# Altium schematic sheet PWR_BUCK.SchDoc
size 420 x 297 mm; SheetNumber: 2; SheetTotal: 2
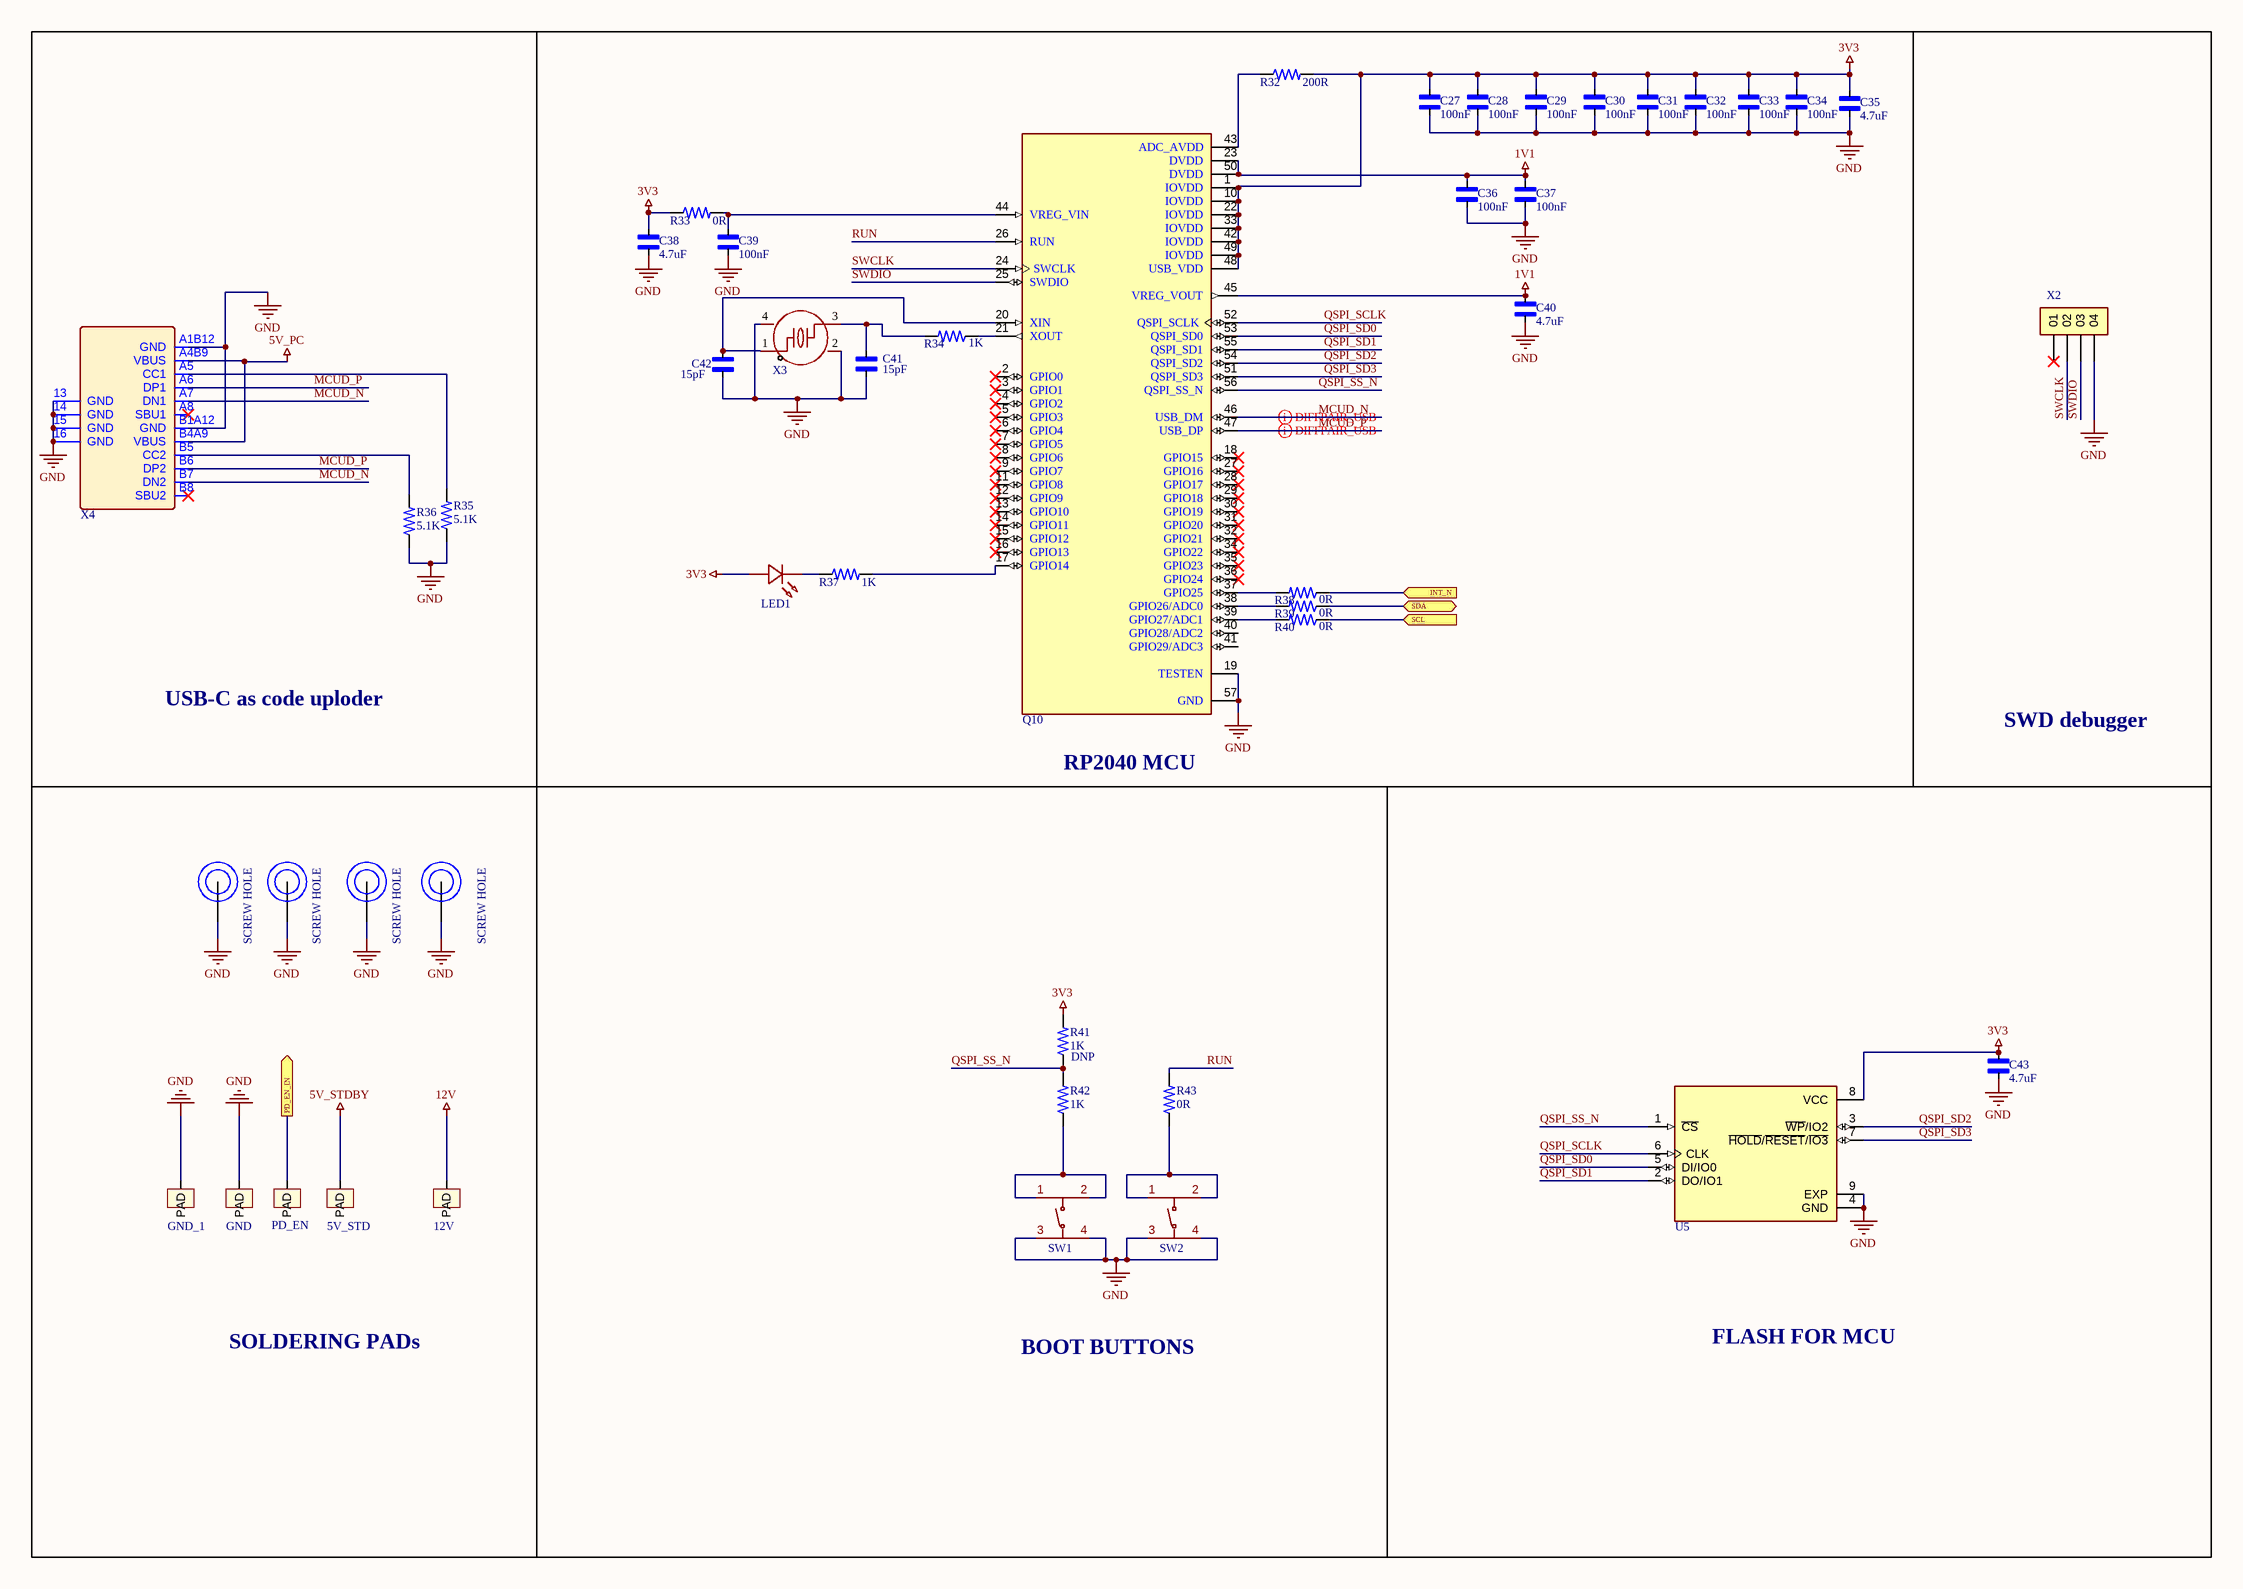
[diagram p0: PWR_BUCK.SchDoc]

## Parts
5V_STD  solder pad  [1mm hole]  (value not drawn)
12V  solder pad  [14 awg]  (value not drawn)
C27  value 100nF  [CAP_0603]  (hidden comment: SMD capacitor)
C28  value 100nF  [CAP_0603]  (hidden comment: SMD capacitor)
C29  value 100nF  [CAP_0603]  (hidden comment: SMD capacitor)
C30  value 100nF  [CAP_0603]  (hidden comment: SMD capacitor)
C31  value 100nF  [CAP_0603]  (hidden comment: SMD capacitor)
C32  value 100nF  [CAP_0603]  (hidden comment: SMD capacitor)
C33  value 100nF  [CAP_0603]  (hidden comment: SMD capacitor)
C34  value 100nF  [CAP_0603]  (hidden comment: SMD capacitor)
C35  value 4.7uF  [CAP_0603]  (hidden comment: SMD capacitor)
C36  value 100nF  [CAP_0603]  (hidden comment: SMD capacitor)
C37  value 100nF  [CAP_0603]  (hidden comment: SMD capacitor)
C38  value 4.7uF  [CAP_0603]  (hidden comment: SMD capacitor)
C39  value 100nF  [CAP_0603]  (hidden comment: SMD capacitor)
C40  value 4.7uF  [CAP_0603]  (hidden comment: SMD capacitor)
C41  value 15pF  [CAP_0603]  (hidden comment: SMD capacitor)
C42  value 15pF  [CAP_0603]  (hidden comment: SMD capacitor)
C43  value 4.7uF  [CAP_0603]  (hidden comment: SMD capacitor)
GND  solder pad  [14 awg]  (value not drawn)
GND_1  solder pad  [1mm hole]  (value not drawn)
LED1  LED  [LED0603-RD_RED]  (value not drawn)
PD_EN  solder pad  [1mm hole]  (value not drawn)
Q10  IC MCU 32BIT EXT MEM 56QFN  [QFN40P700X700X90-57N]  (value not drawn)
R32  value 200R  [RES_0603]  (hidden comment: SMD Resistor)
R33  value 0R  [RES_0603]  (hidden comment: SMD Resistor)
R34  value 1K  [RES_0603]  (hidden comment: SMD resistor)
R35  value 5.1K  [RES_0603]  (hidden comment: SMD resistor)
R36  value 5.1K  [RES_0603]  (hidden comment: SMD resistor)
R37  value 1K  [RES_0603]  (hidden comment: SMD Resistor)
R38  value 0R  [RES_0603]  (hidden comment: SMD resistor)
R39  value 0R  [RES_0603]  (hidden comment: SMD resistor)
R40  value 0R  [RES_0603]  (hidden comment: SMD resistor)
R41  DNP  value 1K  [RES_0603]
R42  value 1K  [RES_0603]  (hidden comment: SMD resistor)
R43  value 0R  [RES_0603]  (hidden comment: SMD resistor)
SH1  SCREW HOLE  [PCB hole]
SH2  SCREW HOLE  [PCB hole]
SH3  SCREW HOLE  [PCB hole]
SH4  SCREW HOLE  [PCB hole]
SW1  Dev  Switch  [SW-SMD_4P-L4.2-W3.3-P2.15-LS5.1]  (value not drawn)
SW2  Dev  Switch  [SW-SMD_4P-L4.2-W3.3-P2.15-LS5.1]  (value not drawn)
U5  SPI Flash  [IC_W25Q16JVUXIQ_TR]  (value not drawn)
X2  Header X 5  [SAMTEC_TS-104-T-A]  (value not drawn)
X3  Crystals  [CRYSTAL-SMD_4P-L3.2-W2.5-BL]  (value not drawn)
X4  USB-C connector  [USB-C-SMD_TYPEC-304J-BCP16]  (value not drawn)

## Ports
INT_N (in, see USB_PD_IC[4A]), PD_EN_IN (out, see USB_PD_IC[1B]), SCL (in, see USB_PD_IC[2A]), SDA (bidir, see USB_PD_IC[2A])

## Nets
1V1: C36.1 C37.1 C40.1 Q10.23(DVDD) Q10.45(VREG_VOUT) Q10.50(DVDD)
3V3: C27.1 C28.1 C29.1 C30.1 C31.1 C32.1 C33.1 C34.1 C35.1 C38.1 C43.1 LED1.2(A) Q10.1(IOVDD) Q10.10(IOVDD) Q10.22(IOVDD) Q10.33(IOVDD) Q10.42(IOVDD) Q10.48(USB_VDD) Q10.49(IOVDD) R32.2 R33.1 R41.2 U5.8(VCC)
5V_PC: X4.A4B9(VBUS) X4.B4A9(VBUS)
5V_STDBY: 5V_STD.1(PAD)
12V: 12V.1(PAD)
GND: C27.2 C28.2 C29.2 C30.2 C31.2 C32.2 C33.2 C34.2 C35.2 C36.2 C37.2 C38.2 C39.2 C40.2 C41.2 C42.2 C43.2 GND.1(PAD) GND_1.1(PAD) Q10.19(TESTEN) Q10.57(GND) R35.1 R36.1 SH1.1 SH2.1 SH3.1 SH4.1 SW1.3 SW1.4 SW2.3 SW2.4 U5.4(GND) U5.9(EXP) X2.04 X3.2(GND) X3.4(GND) X4.13(GND) X4.14(GND) X4.15(GND) X4.16(GND) X4.A1B12(GND) X4.B1A12(GND)
INT_N: R38.1 ; port INT_N
MCUD_N: Q10.46(USB_DM) X4.A7(DN1) X4.B7(DN2)
MCUD_P: Q10.47(USB_DP) X4.A6(DP1) X4.B6(DP2)
PD_EN_IN: PD_EN.1(PAD) ; port PD_EN_IN
QSPI_SCLK: Q10.52(QSPI_SCLK) U5.6(CLK)
QSPI_SD0: Q10.53(QSPI_SD0) U5.5(DI/IO0)
QSPI_SD1: Q10.55(QSPI_SD1) U5.2(DO/IO1)
QSPI_SD2: Q10.54(QSPI_SD2) U5.3(~{WP}/IO2)
QSPI_SD3: Q10.51(QSPI_SD3) U5.7(~{HOLD}/~{RESET}/~{IO3})
QSPI_SS_N: Q10.56(QSPI_SS_N) R41.1 R42.2 U5.1(~{CS})
RUN: Q10.26(RUN) R43.2
SCL: R40.1 ; port SCL
SDA: R39.1 ; port SDA
SWCLK: Q10.24(SWCLK) X2.02
SWDIO: Q10.25(SWDIO) X2.03
NetC39_1: C39.1 Q10.44(VREG_VIN) R33.2
NetC41_1: C41.1 R34.2 X3.3
NetC42_1: C42.1 Q10.20(XIN) X3.1
NetLED1_1: LED1.1(K) R37.1
NetQ10_17: Q10.17(GPIO14) R37.2
NetQ10_21: Q10.21(XOUT) R34.1
NetQ10_37: Q10.37(GPIO25) R38.2
NetQ10_38: Q10.38(GPIO26/ADC0) R39.2
NetQ10_39: Q10.39(GPIO27/ADC1) R40.2
NetQ10_43: Q10.43(ADC_AVDD) R32.1
NetR35_2: R35.2 X4.A5(CC1)
NetR36_2: R36.2 X4.B5(CC2)
NetR42_1: R42.1 SW1.1 SW1.2
NetR43_1: R43.1 SW2.1 SW2.2

Not connected (* = marked no-connect by the designer): Q10 2(GPIO0)* 3(GPIO1)* 4(GPIO2)* 5(GPIO3)* 6(GPIO4)* 7(GPIO5)* 8(GPIO6)* 9(GPIO7)* 11(GPIO8)* 12(GPIO9)* 13(GPIO10)* 14(GPIO11)* 15(GPIO12)* 16(GPIO13)* 18(GPIO15)* 27(GPIO16)* 28(GPIO17)* 29(GPIO18)* 30(GPIO19)* 31(GPIO20)* 32(GPIO21)* 34(GPIO22)* 35(GPIO23)* 36(GPIO24)* 40(GPIO28/ADC2) 41(GPIO29/ADC3); X2 01*; X4 A8(SBU1)* B8(SBU2)*

## Layout directives
differential pair; differential pair class USB: MCUD_N, MCUD_P

## Notes on the sheet
- USB-C as code uploder
- SWD debugger
- (near Q10) RP2040 MCU
- SOLDERING PADs
- BOOT BUTTONS
- FLASH FOR MCU

## Library data of the parts
C27-C43 = CAP_SMD_CERAMIC: Tolerance: ±10%; Package: 0603; Price: *; Voltage: *; JLCPCB Part #: *
LED1 = LED SMD: LED  SMD; Manifacturing Part Number: SZYY0603O; Manifacturing Company Name: Yongyu Photoelectric; Package: 0603; Price: *
Q10 = RP2040: ARM® Cortex®-M0+ - Microcontroller IC 32-Bit Dual-Core 133MHz External Program Memory 56-QFN (7x7); Manifacturing Company Name: Raspberry Pi; Manifacturing Part Number: RP2040; Data Sheet: https://datasheets.raspberrypi.com/rp2040/rp2040-datasheet.pdf; Package: 56-QFN (7x7); Price: *; JLCPCB Part #: C2040
R32-R40 R42 R43 = RES_SMD_CERAMIC: Tolerance: ±5%; Package: 0603; Price: *; JLCPCB Part #: *
R41 = RES_SMD_CERAMIC: SMD Resistor; Tolerance: ±5%; Package: 0603; Price: *; JLCPCB Part #: *
SH1-SH4 = Hole
SW1 SW2 = TS-1089S-02526: 50mA Brick nogging SPST 12V SMD,3.3x4.2mm Tactile Switches ROHS; Manifacturing Company Name: XUNPU; Tolerance: ±5%; Manifacturing Part Number: TS-1089S-02526; Data Sheet: https://datasheet.lcsc.com/lcsc/1912111437_XUNPU-TS-1089S-02526_C455282.pdf; Package: SMD,3.3x4.2mm; Price: *; JLCPCB Part #: C455282
U5 = W25Q16JVUXIQ: 16Mbit 2.7V~3.6V 133MHz SPI USON-8-EP(2x3) Memory (ICs) ROHS; Manifacturing Company Name: Winbond; Manifacturing Part Number: W25Q16JVUXIQ; Data Sheet: https://www.lcsc.com/datasheet/C2843335.pdf; Package: USON-8-EP(2x3); Price: *; Tolerance: N/A; JLCPCB Part #: C2843335
X2 = 4 Pin Header: 4 pin header pitch 2.54mm; Manifacturing Part Number: 2541WV-04P; Manifacturing Company Name: HanElectricity; Data Sheet: https://datasheet.lcsc.com/lcsc/2304140030_BOOMELE-Boom-Precision-Elec-C91552_C91552.pdf; Package: THT P 2.54mm; Price: *; Tolerance: N/A; JLCPCB Part #: C5383113
X3 = ABM8-272-T3: 12 MHz ±30ppm Crystal 10pF 50 Ohms 4-SMD, No Lead; Manifacturing Company Name: ABRACON; Manifacturing Part Number: ABM8-272-T3; Data Sheet: https://mm.digikey.com/Volume0/opasdata/d220001/medias/docus/6536/ABM8_Datasheet.pdf; Package: 3225-4P; Price: *; Tolerance: ±30ppm; JLCPCB Part #: C20625731
X4 = TYPEC-304J-BCP16: 5A USB 3.1 1 Surface Mount, Right Angle 16P Female -40℃~+85℃ Type-C SMD USB Connectors ROHS; Manifacturing Company Name: XUNPU; Manifacturing Part Number: TYPEC-304J-BCP16; Data Sheet: https://www.lcsc.com/datasheet/C2835315.pdf; Package: SMD; Price: *; Tolerance: N/A; JLCPCB Part #: C2835315